# Altium schematic sheet Mecanum.SchDoc
size A3; Organization: Altium Limited; Address1: L3, 12a Rodborough Rd; Address2: Frenchs Forest; Address3: NSW; Address4: Australia 2086
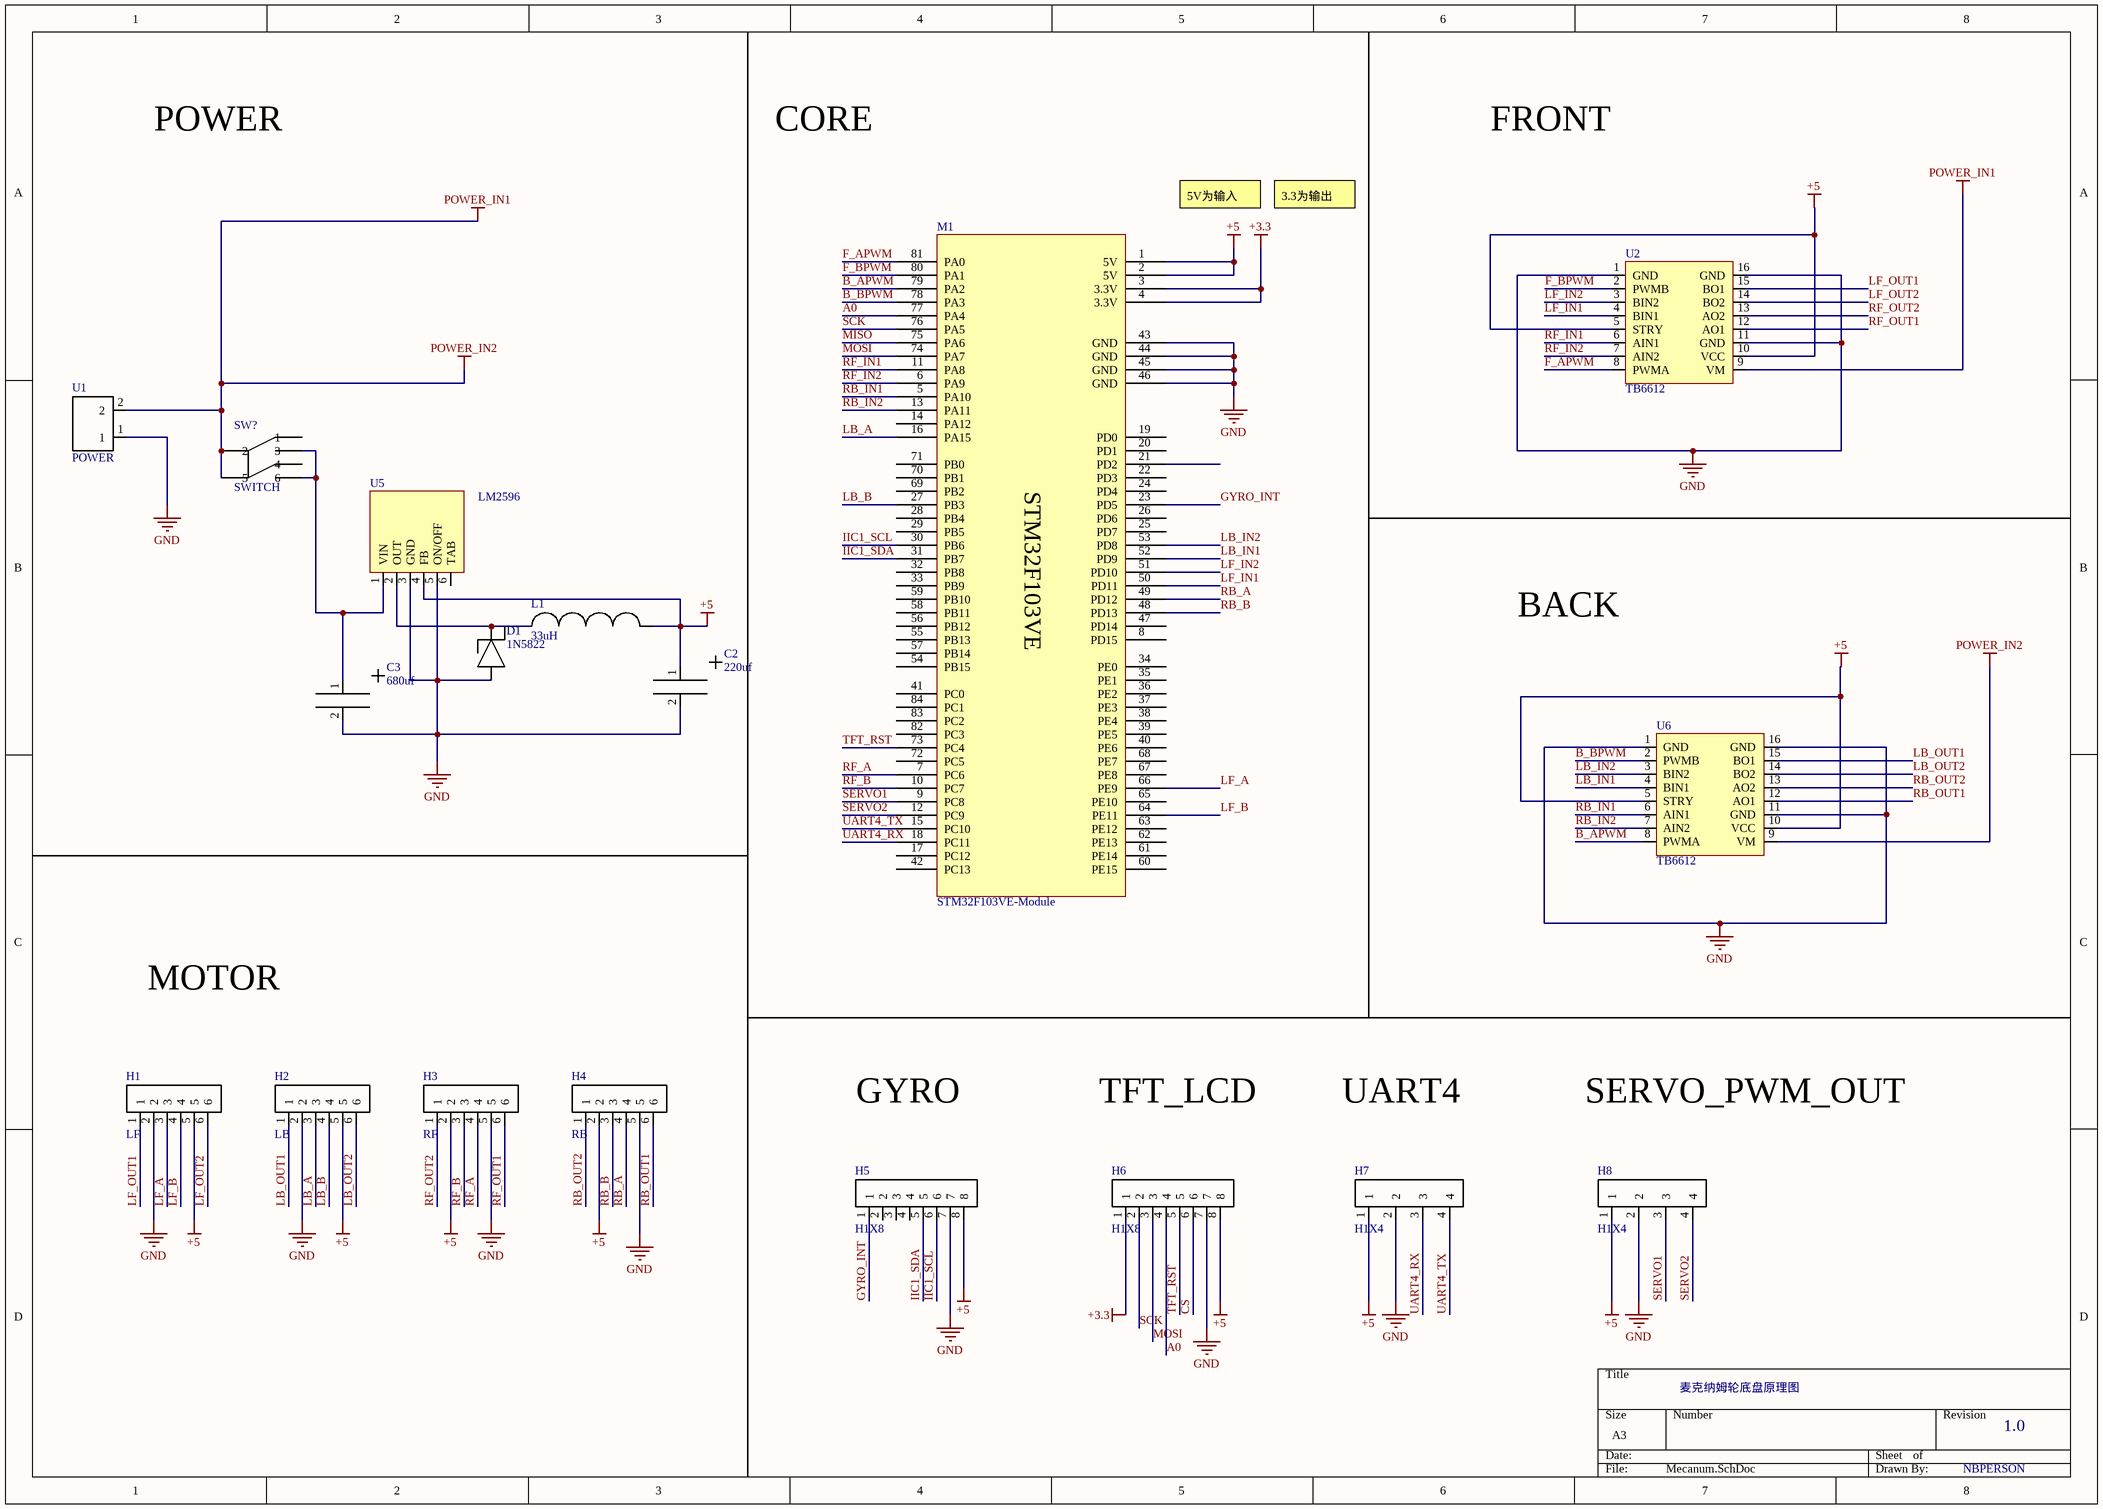
[diagram p0: Mecanum.SchDoc]

## Parts
C2  220uf  [CAP-SMD_BD6.3-L6.6-W6.6-FD]
C3  680uf  [CAP-SMD_BD10.0-L10.3-W10.3-FD]
D1  1N5822  [DO-201AD_BD5.3-L8.4-P12.50-D1.4-RD]
H1  LF  [HDR-TH_6P-P2.54-V]
H2  LB  [HDR-TH_6P-P2.54-V]
H3  RF  [HDR-TH_6P-P2.54-V]
H4  RB  [HDR-TH_6P-P2.54-V]
H5  H1X8  [HDR-TH_8P-P2.54-V]
H6  H1X8  [HDR-TH_8P-P2.54-V]
H7  H1X4  [HDR-TH_4P-P2.54-V]
H8  H1X4  [HDR-TH_4P-P2.54-V]
L1  33uH  [IND-SMD_L12.5-W12.5_SWRH1207B]
M1  STM32F103VE-Module  [STM32F103VE]
SW?  SWITCH  [KEY-6X6]
U1  POWER  [CONN-TH_JL129-50802G01]
U2  TB6612  [BT6612椹卞姩妯″潡]
U5  LM2596  [TO-263-5]
U6  TB6612  [BT6612椹卞姩妯″潡]

## Nets
+3.3: H6.1 M1.3(3.3V) M1.4(3.3V)
+5: C2.1 H1.5 H2.5 H3.2 H4.2 H5.8 H6.8 H7.1 H8.1 L1.2 M1.1(5V) M1.2(5V) U2.5(STRY) U2.10(VCC) U5.4(FB) U6.5(STRY) U6.10(VCC)
GND: C2.2 C3.2 D1.2 H1.2 H2.2 H3.5 H4.5 H5.7 H6.7 H7.2 H8.2 M1.43(GND) M1.44(GND) M1.45(GND) M1.46(GND) U1.1 U2.1(GND) U2.11(GND) U2.16(GND) U5.3(GND) U5.5(ON/OFF) U6.1(GND) U6.11(GND) U6.16(GND)
POWER_IN1: SW?.2 SW?.5 U1.2 U2.9(VM) U6.9(VM)  [also labelled POWER_IN2]
A0: H6.4 M1.77(PA4)
B_APWM: M1.79(PA2) U6.8(PWMA)
B_BPWM: M1.78(PA3) U6.2(PWMB)
CS: H6.6
F_APWM: M1.81(PA0) U2.8(PWMA)
F_BPWM: M1.80(PA1) U2.2(PWMB)
GYRO_INT: H5.1 M1.23(PD5)
IIC1_SCL: H5.6 M1.30(PB6)
IIC1_SDA: H5.5 M1.31(PB7)
LB_A: H2.3 M1.16(PA15)
LB_B: H2.4 M1.27(PB3)
LB_IN1: M1.52(PD9) U6.4(BIN1)
LB_IN2: M1.53(PD8) U6.3(BIN2)
LB_OUT1: H2.1 U6.15(BO1)
LB_OUT2: H2.6 U6.14(BO2)
LF_A: H1.3 M1.66(PE9)
LF_B: H1.4 M1.64(PE11)
LF_IN1: M1.50(PD11) U2.4(BIN1)
LF_IN2: M1.51(PD10) U2.3(BIN2)
LF_OUT1: H1.1 U2.15(BO1)
LF_OUT2: H1.6 U2.14(BO2)
MISO: M1.75(PA6)
MOSI: H6.3 M1.74(PA7)
RB_A: H4.4 M1.49(PD12)
RB_B: H4.3 M1.48(PD13)
RB_IN1: M1.5(PA10) U6.6(AIN1)
RB_IN2: M1.13(PA11) U6.7(AIN2)
RB_OUT1: H4.6 U6.12(AO1)
RB_OUT2: H4.1 U6.13(AO2)
RF_A: H3.4 M1.7(PC6)
RF_B: H3.3 M1.10(PC7)
RF_IN1: M1.11(PA8) U2.6(AIN1)
RF_IN2: M1.6(PA9) U2.7(AIN2)
RF_OUT1: H3.6 U2.12(AO1)
RF_OUT2: H3.1 U2.13(AO2)
SCK: H6.2 M1.76(PA5)
SERVO1: H8.3 M1.9(PC8)
SERVO2: H8.4 M1.12(PC9)
TFT_RST: H6.5 M1.73(PC4)
UART4_RX: H7.3 M1.18(PC11)
UART4_TX: H7.4 M1.15(PC10)
NetC3_1: C3.1 SW?.3 SW?.6 U5.1(VIN)
NetD1_1: D1.1 L1.1 U5.2(OUT)

Not connected (* = marked no-connect by the designer): H5 2 3 4; M1 8(PD15) 14(PA12) 17(PC12) 19(PD0) 20(PD1) 21(PD2) 22(PD3) 24(PD4) 25(PD7) 26(PD6) 28(PB4) 29(PB5) 32(PB8) 33(PB9) 34(PE0) 35(PE1) 36(PE2) 37(PE3) 38(PE4) 39(PE5) 40(PE6) 41(PC0) 42(PC13) 47(PD14) 54(PB15) 55(PB13) 56(PB12) 57(PB14) 58(PB11) 59(PB10) 60(PE15) 61(PE14) 62(PE13) 63(PE12) 65(PE10) 67(PE8) 68(PE7) 69(PB2) 70(PB1) 71(PB0) 72(PC5) 82(PC3) 83(PC2) 84(PC1); SW? 1 4; U5 6(TAB)

## Notes on the sheet
- POWER
- CORE
- FRONT
- 5V为输入
- 3.3为输出
- BACK
- MOTOR
- GYRO
- TFT_LCD
- UART4
- SERVO_PWM_OUT
- 麦克纳姆轮底盘原理图
- 1.0
- NBPERSON
- Title
- Size:
- Date:
- A3
- Number:
- Time:
- Revision:
- Sheet
- of
- File:
- (in symbol CAP_220uf) +
- (in symbol CAP_680uf) +
- (in symbol STM32F103VE-Module) STM32F103VE

## Library data of the parts
C2 = CAP_220uf
C3 = CAP_680uf
H1-H4 = Hander_1X6
H5 H6 = Hander_1X8
H7 H8 = Hander_1X4
U1 = VIN